# EAGLE design progadapter_up (EAGLE 5.00)
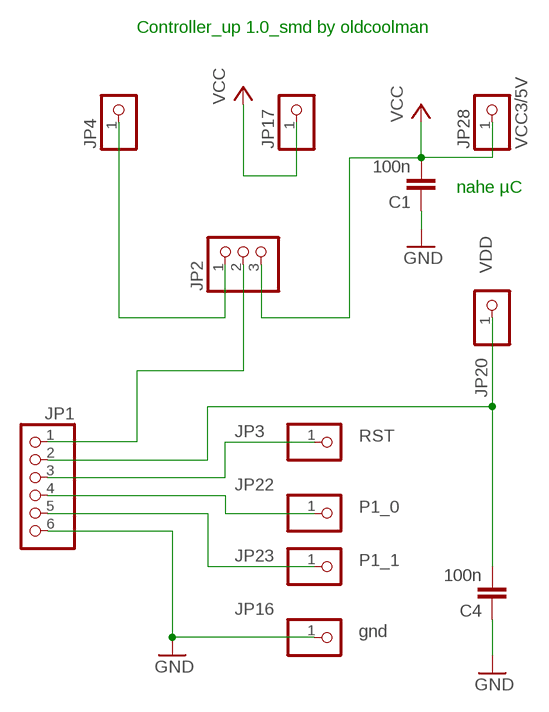
[diagram p0: schematic, sheet 1]

## Parts
C1  100n  C-EU050-024X044  [C050-024X044]
C4  100n  C-EU050-024X044  [C050-024X044]
JP1  PINHD-1X6  [1X06]
JP2  PINHD-1X3  [1X03]
JP3  RST  PINHD-1X1  [1X01]
JP4  PINHD-1X1  [1X01]
JP16  gnd  PINHD-1X1  [1X01]
JP17  PINHD-1X1  [1X01]
JP20  VDD  PINHD-1X1  [1X01]
JP22  P1_0  PINHD-1X1  [1X01]
JP23  P1_1  PINHD-1X1  [1X01]
JP28  VCC3/5V  PINHD-1X1  [1X01]

## Nets
GND: C1.1 C4.1 JP1.6 JP16.1
N$1: JP1.5 JP23.1
N$2: JP1.4 JP22.1
N$3: JP1.3 JP3.1
N$5: JP2.1 JP4.1
N$7: JP1.1 JP2.2
N$32: C4.2 JP1.2 JP20.1
VCC: C1.2 JP2.3 JP17.1 JP28.1

## Notes on the sheet
- Controller_up 1.0_smd by oldcoolman
- nahe µC

## Library data of the parts
C1 C4 = rcl:C-EU: CAPACITOR, European symbol
JP1 = pinhead:PINHD-1X6: PIN HEADER
JP2 = pinhead:PINHD-1X3: PIN HEADER
JP3 JP4 JP16 JP17 JP20 JP22 JP23 JP28 = pinhead:PINHD-1X1: PIN HEADER

## Board
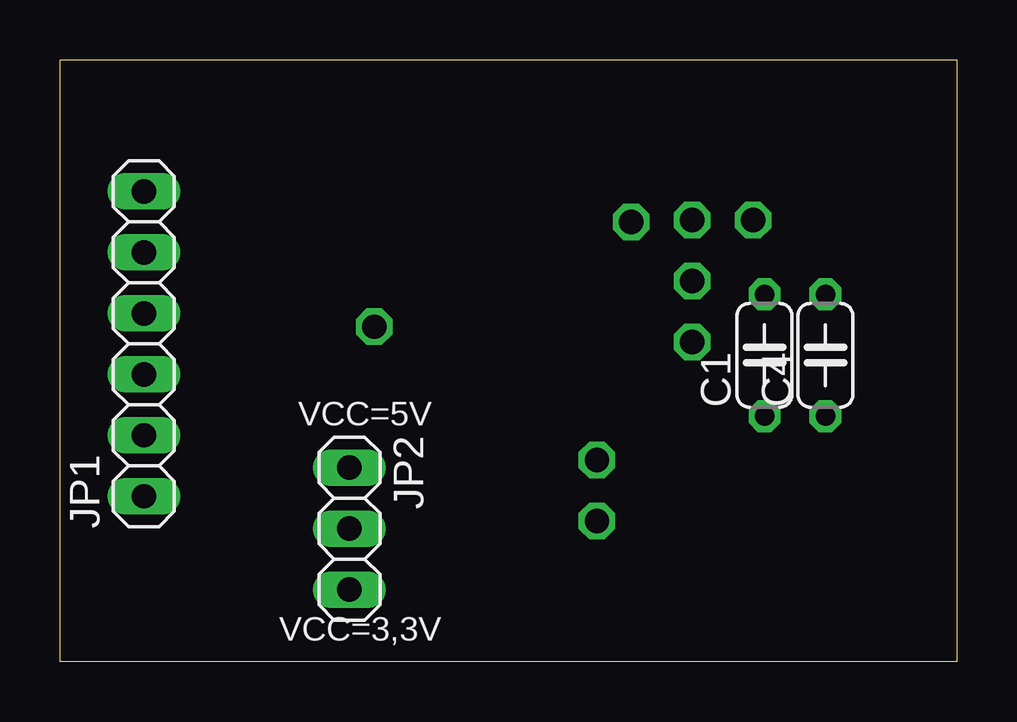
[diagram p1: board, top side]
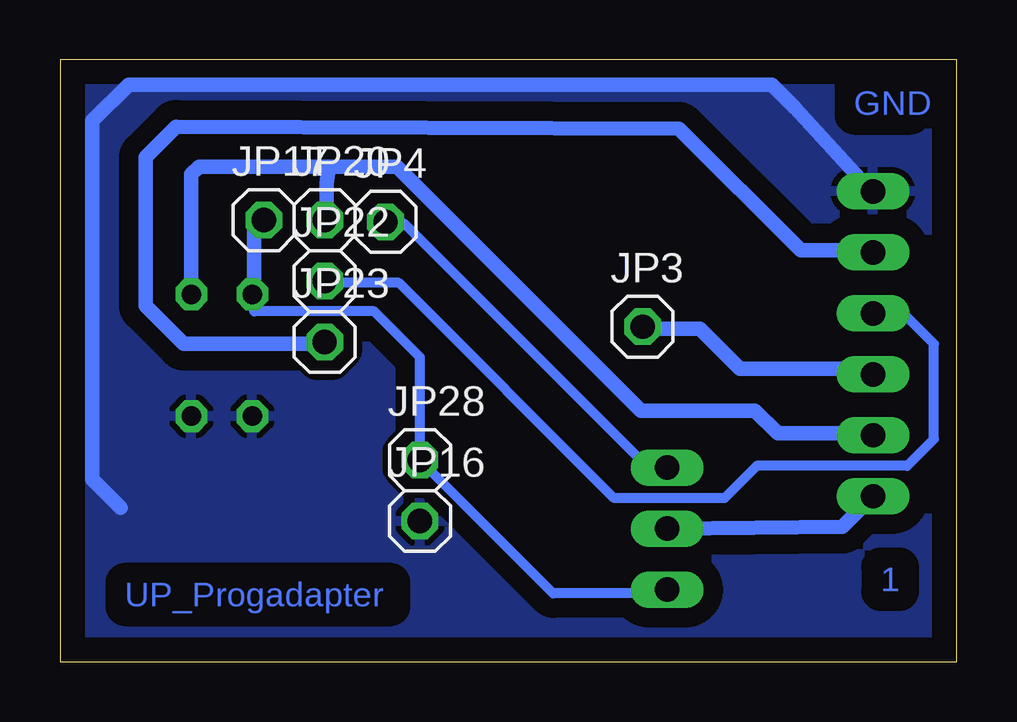
[diagram p2: board, bottom side, seen from below]

Size 37.39 x 25.08 mm. Coordinates in mm from the lower left corner, seen from the top.
Outline: 0,25.08 37.39,25.08 37.39,0 0,0 0,25.08
Copper layers (1*16): Top 0.035mm / dielectric 1.5mm / Bottom 0.035mm
Design rules "default": minimum track width 10mil, minimum drill 24mil, track to track 8mil, track to pad 8mil, pad to pad 8mil, via to via 8mil, smd to smd 8mil, copper to edge 40mil, drill to drill 8mil, minimum pad ring 10mil, minimum via ring 8mil, stop-mask expansion 4mil, vias tented up to drill 0mil, thermal gap 10mil

### Footprints (pad centres in the part's own frame; a part is rotated, then mirrored left to right if it is on the bottom)
C050-024X044 = drill 0.813 octagon: 1 -2.54,0; 2 2.54,0
1X06 = drill 1.016 long: 1 -6.35,0; 2 -3.81,0; 3 -1.27,0; 4 1.27,0; 5 3.81,0; 6 6.35,0
1X03 = drill 1.016 long: 1 -2.54,0; 2 0,0; 3 2.54,0
1X01 = drill 1.016 octagon: 1 0,0

### Placement (x,y rotation side)
C1  29.37,12.78 90 top
C4  31.91,12.78 90 top
JP1  3.49,13.26 90 top
JP2  12.07,5.56 270 top
JP3  13.1,13.97 0 bottom
JP4  23.81,18.34 0 bottom
JP16  22.38,5.87 0 bottom
JP17  28.89,18.41 0 bottom
JP20  26.35,18.41 0 bottom
JP22  26.35,15.87 0 bottom
JP23  26.35,13.33 0 bottom
JP28  22.38,8.41 0 bottom

### Tracks (layer width: path | path; a pad name or v marks a point on that pad's centre or on a via)
GND
  Bottom 0.61: JP1.6 3.57,19.61 6.75,23.1 7.7,24.05 34.53,24.05 36.04,22.54 36.04,7.62 34.85,6.43
  pour Bottom (isolate 0.813): -0.24,25.64 0,25.88 37.62,25.88 37.62,-0.08 -0.16,-0.08
N$1
  Bottom 0.61: JP1.5 3.57,17.14 6.51,17.14 11.59,22.22 32.54,22.3 33.81,21.03 33.81,14.84 32.23,13.26 26.43,13.26 JP23.1
N$2
  Bottom 0.406: JP1.4 2.22,14.53 0.95,13.26 0.95,9.29 2.06,8.18 8.33,8.18 9.68,6.83 14.29,6.83 23.26,15.8 26.35,15.8 JP22.1 | JP22.1
  Bottom 0.61: JP1.4 3.65,14.68
N$3
  Bottom 0.61: JP1.3 3.73,12.22 9.05,12.22 10.72,13.89 13.02,13.89 JP3.1
N$5
  Bottom 0.406: JP2.1 12.14,8.18 12.94,8.18 23.02,18.26 23.73,18.26 JP4.1
N$7
  Bottom 0.61: 11.03,5.64 JP2.2 4.76,5.64 JP1.1
N$32
  Bottom 0.61: JP1.2 3.57,9.52 7.46,9.52 8.41,10.48 13.18,10.48 23.34,20.64 26.11,20.64 | 26.27,18.33 26.27,18.26 | 26.27,18.33 JP20.1 | 26.11,20.64 26.19,20.56 | 26.19,20.56 26.27,19.92 26.27,18.33 | 26.19,20.56 26.11,20.64 | 26.11,20.64 31.59,20.64 31.91,20.32 31.91,16.91 C4.2 31.83,15.32
VCC
  Bottom 0.406: JP2.3 12.14,2.94 12.14,2.86 16.83,2.86 JP28.1 | 29.29,15.4 29.29,14.6 24.29,14.6 22.38,12.7 JP28.1 | JP28.1 | JP28.1
  Bottom 0.61: JP17.1 29.29,18.01 29.29,15.4 29.29,15.32 C1.2 | C1.2

### Text on the board
Bottom: GND | 1 | UP_Progadapter
tPlace: VCC=5V | VCC=3,3V